# EAGLE design forcefoot (EAGLE 6.1)
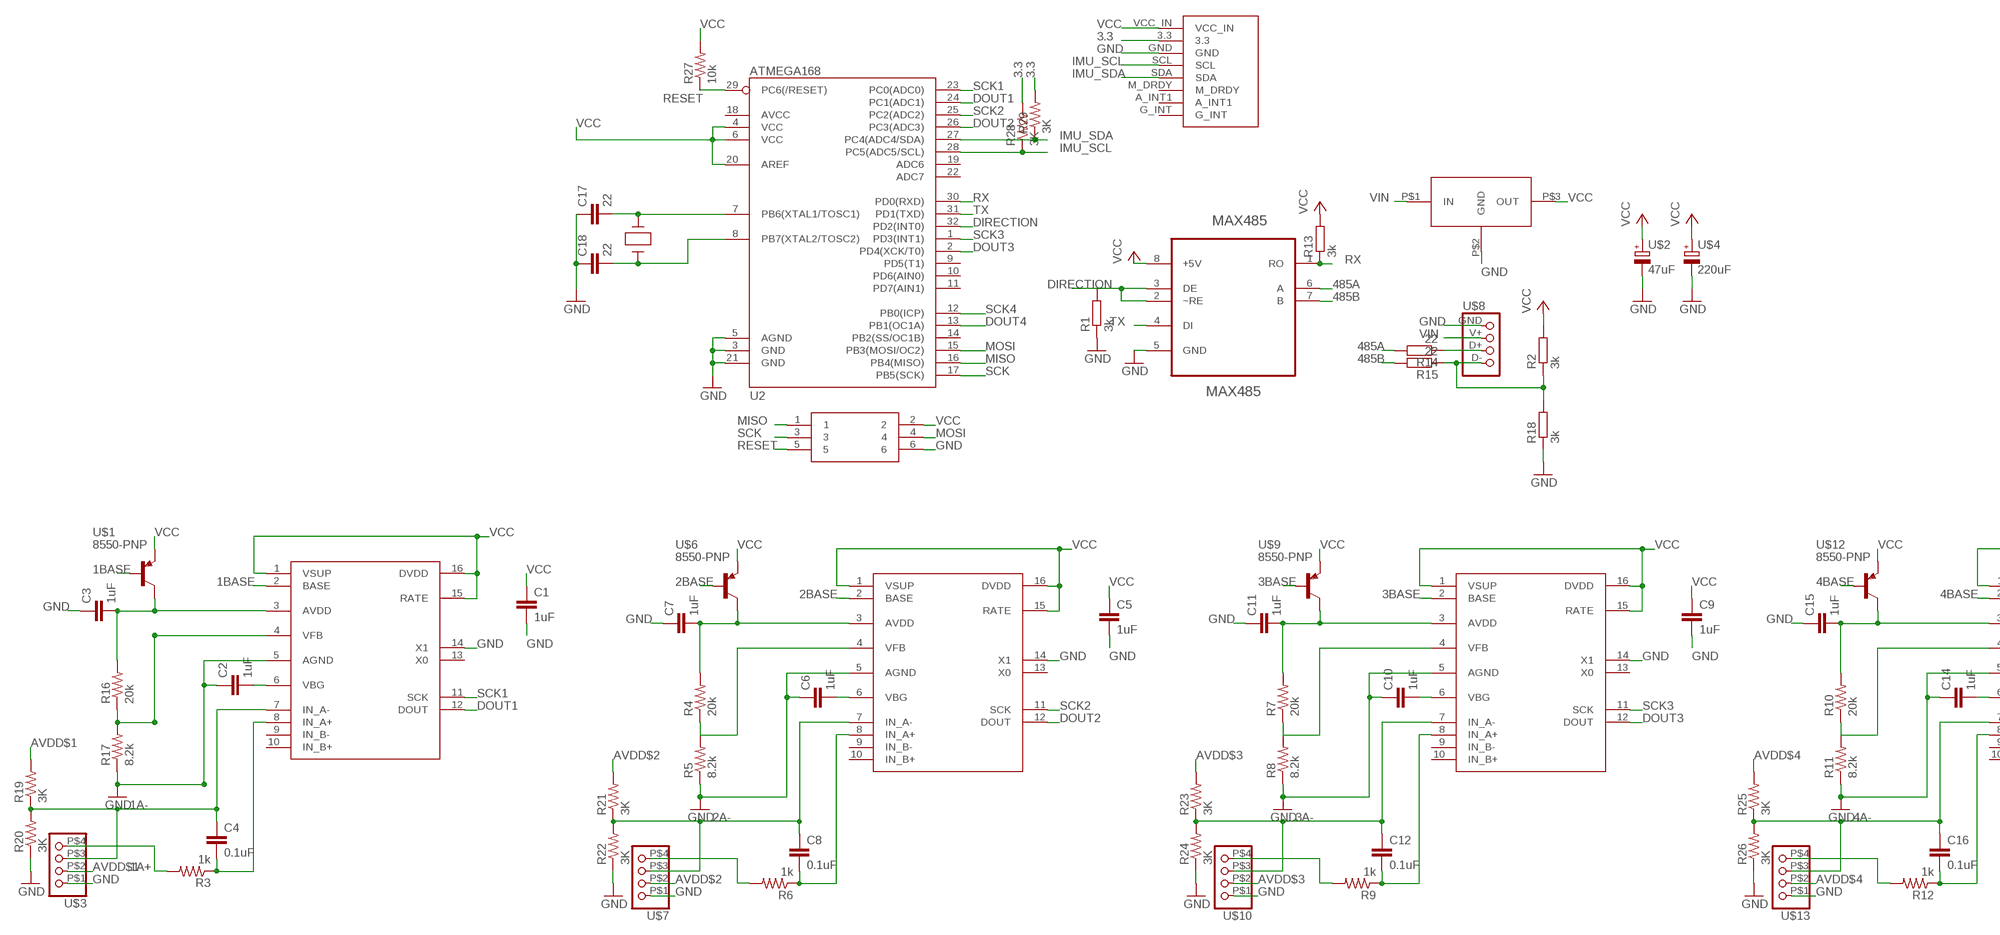
[diagram p0: schematic, sheet 1, part 1 of 2]
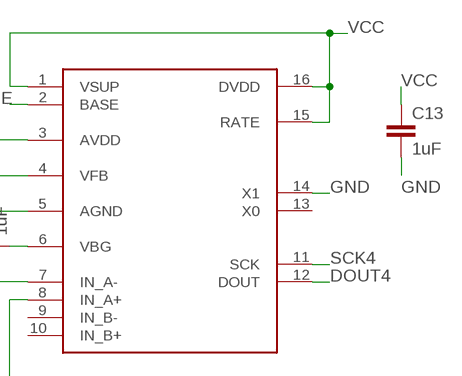
[diagram p1: schematic, sheet 1, part 2 of 2]

## Parts
C1  1uF  CAP0805  [0805]
C2  1uF  CAP0805  [0805]
C3  1uF  CAP0805  [0805]
C4  0.1uF  CAP0805  [0805]
C5  1uF  CAP0805  [0805]
C6  1uF  CAP0805  [0805]
C7  1uF  CAP0805  [0805]
C8  0.1uF  CAP0805  [0805]
C9  1uF  CAP0805  [0805]
C10  1uF  CAP0805  [0805]
C11  1uF  CAP0805  [0805]
C12  0.1uF  CAP0805  [0805]
C13  1uF  CAP0805  [0805]
C14  1uF  CAP0805  [0805]
C15  1uF  CAP0805  [0805]
C16  0.1uF  CAP0805  [0805]
C17  22  C_EU_22PF  [C0603]
C18  22  C_EU_22PF  [C0603]
HX1  HX711SO16  [SO16]
HX2  HX711SO16  [SO16]
HX3  HX711SO16  [SO16]
HX4  HX711SO16  [SO16]
MAX485  MAX485  [SO8]
R1  3k  RESISTANCE-R0805  [R0805]
R2  3k  RESISTANCE-R0805  [R0805]
R3  1k  RESISTOR0805-RES  [0805]
R4  20k  RESISTOR0805-RES  [0805]
R5  8.2k  RESISTOR0805-RES  [0805]
R6  1k  RESISTOR0805-RES  [0805]
R7  20k  RESISTOR0805-RES  [0805]
R8  8.2k  RESISTOR0805-RES  [0805]
R9  1k  RESISTOR0805-RES  [0805]
R10  20k  RESISTOR0805-RES  [0805]
R11  8.2k  RESISTOR0805-RES  [0805]
R12  1k  RESISTOR0805-RES  [0805]
R13  3k  RESISTANCE-R0805  [R0805]
R14  22  RESISTANCE-R0805  [R0805]
R15  22  RESISTANCE-R0805  [R0805]
R16  20k  RESISTOR0805-RES  [0805]
R17  8.2k  RESISTOR0805-RES  [0805]
R18  3k  RESISTANCE-R0805  [R0805]
R19  3K  RESISTOR0805-RES  [0805]
R20  3K  RESISTOR0805-RES  [0805]
R21  3K  RESISTOR0805-RES  [0805]
R22  3K  RESISTOR0805-RES  [0805]
R23  3K  RESISTOR0805-RES  [0805]
R24  3K  RESISTOR0805-RES  [0805]
R25  3K  RESISTOR0805-RES  [0805]
R26  3K  RESISTOR0805-RES  [0805]
R27  10k  RESISTOR0805-RES  [0805]
R28  3K  RESISTOR0805-RES  [0805]
R29  3K  RESISTOR0805-RES  [0805]
U2  ATMEGA168  [TQFP32-08]
U$1  8550-PNP  [SOT-23]
U$2  47uF  CPOL_EUPANASONIC_D  [PANASONIC_D]
U$3  CONNEC_1X041.5  [4P1.5]
U$4  220uF  CPOL_EUPANASONIC_D8  [PANASONIC_D8]
U$5  REG_5V  [TRACOPOWER]
U$6  8550-PNP  [SOT-23]
U$7  CONNEC_1X041.5  [4P1.5]
U$8  CONNEC_1X04_485  [CONNEC_485]
U$9  8550-PNP  [SOT-23]
U$10  CONNEC_1X041.5  [4P1.5]
U$12  8550-PNP  [SOT-23]
U$13  CONNEC_1X041.5  [4P1.5]
U$17  GY-85  [GY-85]
U$28  CONNEC_2X03  [CONNEC_2X03]
XTAL1  QUARTZ  [HC49US]

## Nets
1A+: R3.2 U$3.P$4
1A-: C4.1 HX1.7(IN_A-) R19.1 R20.2 U$3.P$3
1BASE: HX1.2(BASE) U$1.1(B)
2A-: C8.1 HX2.7(IN_A-) R21.1 R22.2 U$7.P$3
2BASE: HX2.2(BASE) U$6.1(B)
3.3: R28.2 R29.2 U$17.3.3
3A-: C12.1 HX3.7(IN_A-) R23.1 R24.2 U$10.P$3
3BASE: HX3.2(BASE) U$9.1(B)
4A-: C16.1 HX4.7(IN_A-) R25.1 R26.2 U$13.P$3
4BASE: HX4.2(BASE) U$12.1(B)
485A: MAX485.6(A) R14.2
485B: MAX485.7(B) R15.2
AVDD$1: C3.2 HX1.3(AVDD) R16.2 R19.2 U$1.3(C) U$3.P$2
AVDD$2: C7.2 HX2.3(AVDD) R4.2 R21.2 U$6.3(C) U$7.P$2
AVDD$3: C11.2 HX3.3(AVDD) R7.2 R23.2 U$9.3(C) U$10.P$2
AVDD$4: C15.2 HX4.3(AVDD) R10.2 R25.2 U$12.3(C) U$13.P$2
DIRECTION: MAX485.2(~RE) MAX485.3(DE) R1.2 U2.32(PD2(INT0))
DOUT1: HX1.12(DOUT) U2.24(PC1(ADC1))
DOUT2: HX2.12(DOUT) U2.26(PC3(ADC3))
DOUT3: HX3.12(DOUT) U2.2(PD4(XCK/T0))
DOUT4: HX4.12(DOUT) U2.13(PB1(OC1A))
GND: C1.2 C2.1 C3.1 C5.2 C6.1 C7.1 C9.2 C10.1 C11.1 C13.2 C14.1 C15.1 C17.1 C18.1 HX1.5(AGND) HX1.14(X1) HX2.5(AGND) HX2.14(X1) HX3.5(AGND) HX3.14(X1) HX4.5(AGND) HX4.14(X1) MAX485.5(GND) R1.1 R5.1 R8.1 R11.1 R17.1 R18.1 R20.1 R22.1 R24.1 R26.1 U2.3(GND) U2.5(AGND) U2.21(GND) U$2.- U$3.P$1 U$4.- U$5.P$2(GND) U$7.P$1 U$8.GND U$10.P$1 U$13.P$1 U$17.GND U$28.6
IMU_SCL: R28.1 U2.28(PC5(ADC5/SCL)) U$17.SCL
IMU_SDA: R29.1 U2.27(PC4(ADC4/SDA)) U$17.SDA
INAP$1: C4.2 HX1.8(IN_A+) R3.1
INAP$2: C8.2 HX2.8(IN_A+) R6.1
INAP$3: C12.2 HX3.8(IN_A+) R9.1
INAP$4: C16.2 HX4.8(IN_A+) R12.1
MISO: U2.16(PB4(MISO)) U$28.1
MOSI: U2.15(PB3(MOSI/OC2)) U$28.4
N$1: C2.2 HX1.6(VBG)
N$3: C6.2 HX2.6(VBG)
N$4: R6.2 U$7.P$4
N$5: C10.2 HX3.6(VBG)
N$6: R9.2 U$10.P$4
N$7: C14.2 HX4.6(VBG)
N$8: R12.2 U$13.P$4
N$19: C17.2 U2.7(PB6(XTAL1/TOSC1)) XTAL1.2
N$20: C18.2 U2.8(PB7(XTAL2/TOSC2)) XTAL1.1
RESET: R27.1 U2.29(PC6(/RESET)) U$28.5
RS+: R14.1 U$8.D+
RS-: R2.1 R15.1 R18.2 U$8.D-
RX: MAX485.1(RO) R13.1 U2.30(PD0(RXD))
SCK: U2.17(PB5(SCK)) U$28.3
SCK1: HX1.11(SCK) U2.23(PC0(ADC0))
SCK2: HX2.11(SCK) U2.25(PC2(ADC2))
SCK3: HX3.11(SCK) U2.1(PD3(INT1))
SCK4: HX4.11(SCK) U2.12(PB0(ICP))
TX: MAX485.4(DI) U2.31(PD1(TXD))
VCC: C1.1 C5.1 C9.1 C13.1 HX1.1(VSUP) HX1.15(RATE) HX1.16(DVDD) HX2.1(VSUP) HX2.15(RATE) HX2.16(DVDD) HX3.1(VSUP) HX3.15(RATE) HX3.16(DVDD) HX4.1(VSUP) HX4.15(RATE) HX4.16(DVDD) MAX485.8(+5V) R2.2 R13.2 R27.2 U2.4(VCC) U2.6(VCC) U2.20(AREF) U$1.2(E) U$2.+ U$4.+ U$5.P$3(OUT) U$6.2(E) U$9.2(E) U$12.2(E) U$17.VCC_IN U$28.2
VFB$1: HX1.4(VFB) R16.1 R17.2
VFB$2: HX2.4(VFB) R4.1 R5.2
VFB$3: HX3.4(VFB) R7.1 R8.2
VFB$4: HX4.4(VFB) R10.1 R11.2
VIN: U$5.P$1(IN) U$8.V+
Unconnected: HX1.9(IN_B-) HX1.10(IN_B+) HX1.13(X0) HX2.9(IN_B-) HX2.10(IN_B+) HX2.13(X0) HX3.9(IN_B-) HX3.10(IN_B+) HX3.13(X0) HX4.9(IN_B-) HX4.10(IN_B+) HX4.13(X0) U2.9(PD5(T1)) U2.10(PD6(AIN0)) U2.11(PD7(AIN1)) U2.14(PB2(SS/OC1B)) U2.18(AVCC) U2.19(ADC6) U2.22(ADC7) U$17.A_INT1 U$17.G_INT U$17.M_DRDY

## Library data of the parts
C1-C16 = SparkFun-Passives:CAP: Capacitor Standard 0603 ceramic capacitor, and 0.1" leaded capacitor.
C17 C18 = rhoban:C_EU: non polarised condo
HX1-HX4 = rhoban:HX711
MAX485 = rhoban:MAX485; DATASHEET: max485.pdf; DESCRIPTION: ±15kV ESD-Protected, Slew-Rate-Limited, Low-Power, RS-485/RS-422 Transceivers; FARNELL_LINK: http://fr.farnell.com/maxim-integrated-products/max485eesa/transceiver-rs-485-422-cms/dp/1379973?Ntt=1379973; MPN: MAX485EESA+; OC_FARNELL: 1379973; OC_NEWARK: 68K4798; PACKAGE: SOIC-8; SUPPLIER: Maxim
R1 R2 R13-R15 R18 = rhoban:RESISTANCE: RESISTOR, European symbol
R3-R12 R16 R17 R19-R29 = SparkFun-Passives:RESISTOR: Resistor Basic schematic elements and footprints for 0603, 1206, and PTH resistors.
U2 = SparkFun-DigitalIC:ATMEGA168: Atmel 32-pin 8-bit micro, 16k flash.
U$1 U$6 U$9 U$12 = rhoban:8550-PNP
U$2 U$4 = rhoban:CPOL_EU: 680 uF 16 V : http://fr.farnell.com/panasonic/eeufr1c681l/condensateur-radial-16v-680uf/dp/1800635 680 uF 25 V : http://fr.farnell.com/panasonic/eeufr1e681l/capacitor-radial-25v-680uf-20/dp/2063069 330 uF 25 V : http://fr.farnell.com/panasonic/eeufr1e331/condensateur-radial-25v-330uf/dp/1800648?Ntt=eeufr1e331
U$3 U$7 U$8 U$10 U$13 = rhoban:CONNEC_1X04
U$5 = rhoban:REG_5V
U$17 = rhoban:GY-85
U$28 = rhoban:CONNEC_2X03
XTAL1 = rhoban:QUARTZ

## Board
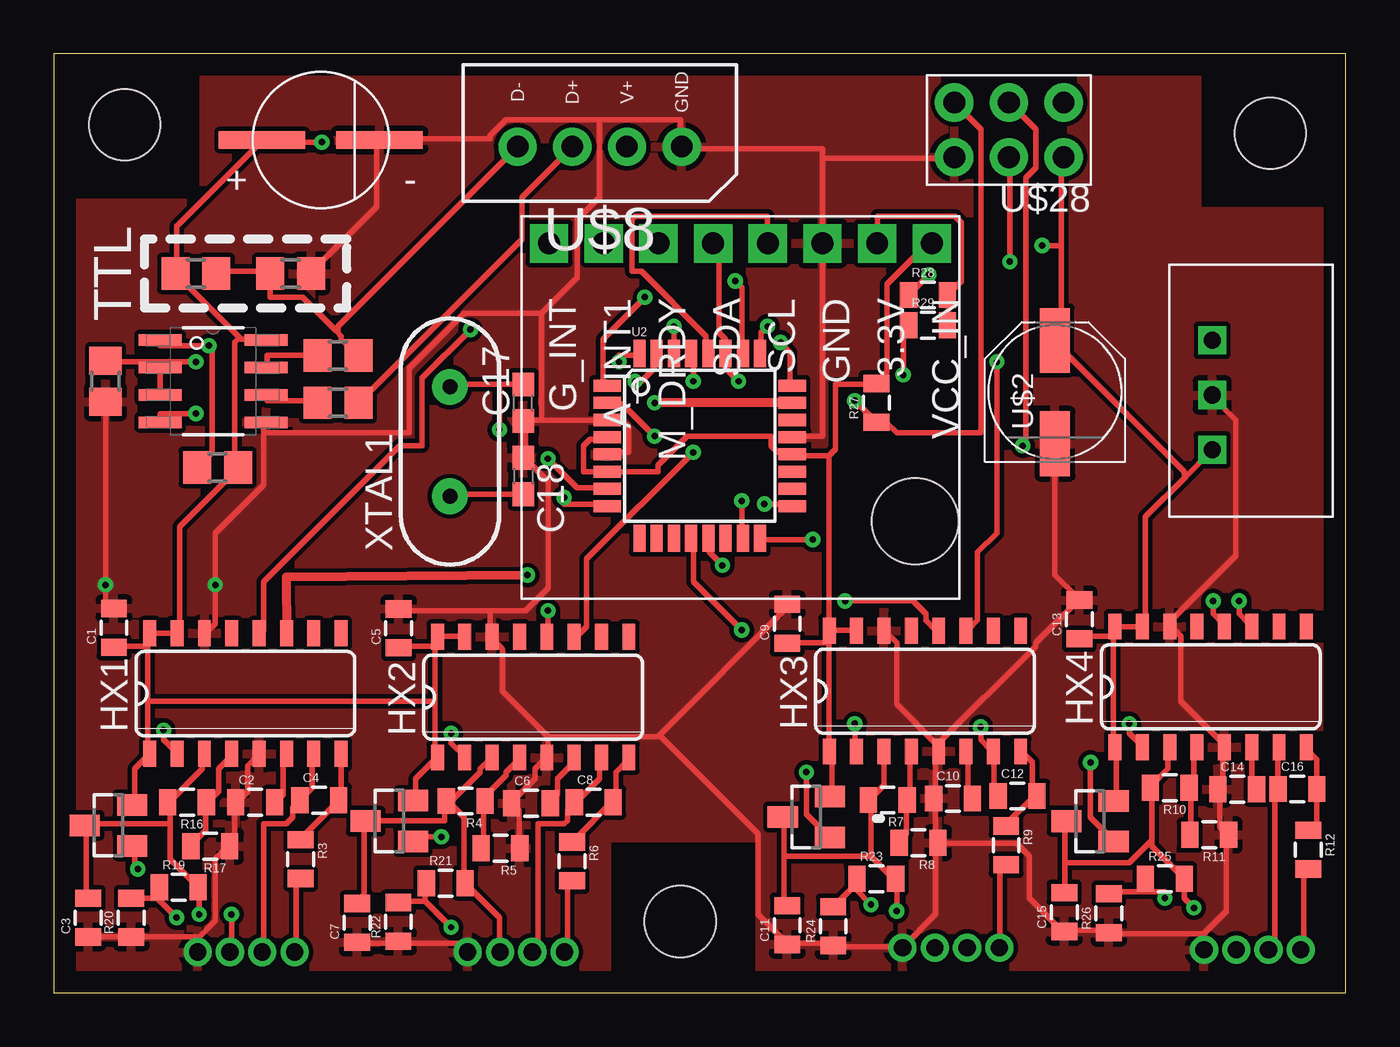
[diagram p2: board, top side]
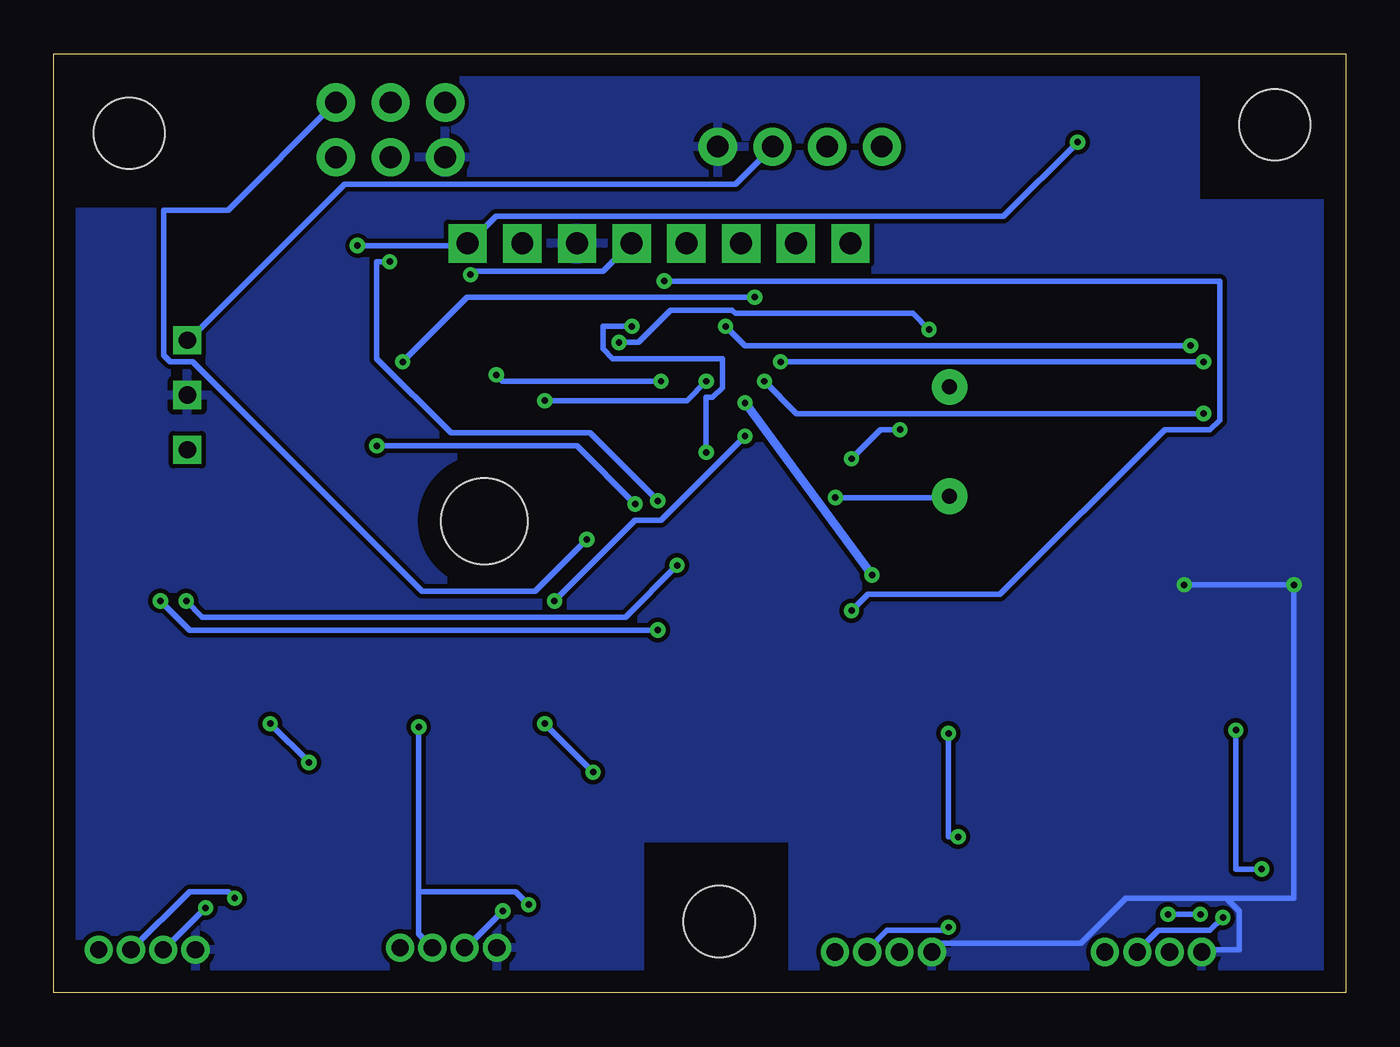
[diagram p3: board, bottom side, seen from below]

Size 60 x 43.6 mm. Coordinates in mm from the lower left corner, seen from the top.
Outline: 0,0 60,0 60,43.6 0,43.6 0,0
Copper layers (1*16): Top 0.035mm / dielectric 1.5mm / Bottom 0.035mm
Design rules: minimum track width 10mil, minimum drill 0.3mm, track to track 0.205mm, track to pad 0.205mm, pad to pad 0.205mm, via to via 0.205mm, smd to smd 8mil, copper to edge 40mil, drill to drill 8mil, minimum pad ring 10mil, minimum via ring 8mil, stop-mask expansion 4mil, vias tented up to drill 25mil, thermal gap 10mil
tRestrict: area 0.1,36.9 to 6.8,44; area 53.3,36.5 to 60,43.6; area 25.9,-0.1 to 32.6,7
bRestrict: area 0.1,36.9 to 6.8,44; area 53.3,36.5 to 60,43.6; area 25.9,-0.1 to 32.6,7

### Footprints (pad centres in the part's own frame; a part is rotated, then mirrored left to right if it is on the bottom)
0805 = smd 0.8 x 1.2: 1 -0.9,0; 2 0.9,0
C0603 = smd 1.1 x 1: 1 -0.85,0; 2 0.85,0
SO16 = smd 1.2 x 0.6: 1 -2.8,4.445; 2 -2.8,3.175; 3 -2.8,1.905; 4 -2.8,0.635; 5 -2.8,-0.635; 6 -2.8,-1.905; 7 -2.8,-3.175; 8 -2.8,-4.445; 9 2.8,-4.445; 10 2.8,-3.175; 11 2.8,-1.905; 12 2.8,-0.635; 13 2.8,0.635; 14 2.8,1.905; 15 2.8,3.175; 16 2.8,4.445
SO8 = smd 1.981 x 0.533: 1 -2.464,1.905; 2 -2.464,0.635; 3 -2.464,-0.635; 4 -2.464,-1.905; 5 2.464,-1.905; 6 2.464,-0.635; 7 2.464,0.635; 8 2.464,1.905
R0805 = smd 1.3 x 1.5: 1 -0.95,0; 2 0.95,0
TQFP32-08 = smd 1.27 x 0.559: 1 -4.293,2.8; 2 -4.293,2; 3 -4.293,1.2; 4 -4.293,0.4; 5 -4.293,-0.4; 6 -4.293,-1.2; 7 -4.293,-2; 8 -4.293,-2.8; 17 4.293,-2.8; 18 4.293,-2; 19 4.293,-1.2; 20 4.293,-0.4; 21 4.293,0.4; 22 4.293,1.2; 23 4.293,2; 24 4.293,2.8 | smd 0.559 x 1.27: 9 -2.8,-4.293; 10 -2,-4.293; 11 -1.2,-4.293; 12 -0.4,-4.293; 13 0.4,-4.293; 14 1.2,-4.293; 15 2,-4.293; 16 2.8,-4.293; 25 2.8,4.293; 26 2,4.293; 27 1.2,4.293; 28 0.4,4.293; 29 -0.4,4.293; 30 -1.2,4.293; 31 -2,4.293; 32 -2.8,4.293
SOT-23 = smd 1 x 1.4: 1 -0.95,-1.1; 2 0.95,-1.1; 3 0,1.1
PANASONIC_D = smd 3 x 1.4: + 2.4,0; - -2.4,0
4P1.5 = drill 0.8: P$1 0,0; P$2 1.5,0; P$3 3,0; P$4 4.5,0
PANASONIC_D8 = smd 4.016 x 0.8: + 2.73,0; - -2.73,0
TRACOPOWER = drill 0.8 square: P$1 3.5,2; P$2 6.04,2; P$3 8.58,2
CONNEC_485 = drill 1 pad 1.778: D+ 7.62,3.81; D- 10.16,3.81; GND 2.54,3.81; V+ 5.08,3.81
STAND-OFF = hole 3.302: 0,0
GY-85 = drill 1.016 pad 1.778 square: 3.3 0,15.24; A_INT1 0,2.54; G_INT 0,0; GND 0,12.7; M_DRDY 0,5.08; SCL 0,10.16; SDA 0,7.62; VCC_IN 0,17.78 | hole 4: 12.9,17
CONNEC_2X03 = drill 1.016 pad 1.778: 1 0,-2.54; 2 0,0; 3 2.54,-2.54; 4 2.54,0; 5 5.08,-2.54; 6 5.08,0
HC49US = drill 0.7 pad 1.651: 1 -2.54,0; 2 2.54,0

### Placement (x,y rotation side)
C1  2.79,16.95 90 top
C2  9.35,8.85 0 top
C3  1.6,3.5 90 top
C4  12.33,8.95 0 top
C5  16.01,16.93 90 top
C6  22.16,8.8 0 top
C7  14.09,3.25 90 top
C8  25.07,8.85 0 top
C9  34.06,17.14 90 top
C10  41.76,9.03 0 top
C11  34.06,3.15 90 top
C12  44.76,9.14 0 top
C13  47.63,17.34 90 top
C14  54.96,9.46 0 top
C15  46.93,3.75 90 top
C16  57.76,9.47 0 top
C17  21.8,27.4 90 top
C18  21.8,24 270 top
HX1  8.9,13.9 90 top
HX2  22.26,13.73 90 top
HX3  40.46,14.01 90 top
HX4  53.73,14.21 90 top
MAX485  7.4,28.4 0 top
R1  2.4,28.4 90 top
R2  6.6,33.4 180 top
R3  11.46,6.21 270 top
R4  19.13,8.91 180 top
R5  20.74,6.71 180 top
R6  24.07,6.11 270 top
R7  38.73,8.96 180 top
R8  40.16,6.97 180 top
R9  44.23,6.85 270 top
R10  51.83,9.53 180 top
R11  53.66,7.34 180 top
R12  58.26,6.65 270 top
R13  7.6,24.4 0 top
R14  13.2,27.4 180 top
R15  13.2,29.6 180 top
R16  6.19,8.86 180 top
R17  7.26,6.82 180 top
R18  11,33.4 180 top
R19  5.8,4.9 0 top
R20  3.6,3.5 90 top
R21  18.2,5.1 0 top
R22  16,3.3 90 top
R23  38.2,5.3 0 top
R24  36.2,3.1 90 top
R25  51.6,5.3 0 top
R26  49,3.7 90 top
R27  38.2,27.4 90 top
R28  40.6,32.4 0 top
R29  40.6,31 0 top
U2  30,25.4 0 top
U$1  2.54,7.78 90 top
U$2  46.5,27.9 90 top
U$3  6.68,1.9 0 top
U$4  12.4,39.6 180 top
U$5  51.8,33.8 270 top
U$6  15.58,7.98 90 top
U$7  19.22,1.9 0 top
U$8  31.7,43.1 180 top
U$9  34.95,8.17 90 top
U$10  39.42,2.1 0 top
U$11  [STAND-OFF]  3.3,40.31 0 top
U$12  48.12,7.97 90 top
U$13  53.42,2 0 top
U$14  [STAND-OFF]  56.5,39.91 0 top
U$16  [STAND-OFF]  29.1,3.31 0 top
U$17  23,34.8 270 top
U$28  46.9,38.8 180 top
XTAL1  18.4,25.6 90 top

### Tracks (layer width: path | path; a pad name or v marks a point on that pad's centre or on a via)
1A+
  Top 0.254: R3.2 11.4,5.3 11.25,5.15 11.25,2 U$3.P$4
1A-  (via drill 0.3)
  Top 0.254: HX1.7 12,11 12,9.5 11.55,9.05 C4.1 11.4,8.9 11.1,8.6 11.1,8.15 10.8,7.85 9.75,7.85 9.75,2 U$3.P$3 | 4.8,4.4 R20.2 | 4.8,4.4 4.8,4.85 R19.1 4.8,4.4 | v5.7,3.5 4.8,4.4
  Bottom 0.254: v5.7,3.5 6.3,2.9 8.7,2.9 9.6,2 U$3.P$3
1BASE  (via drill 0.3)
  Top 0.254: v5.1,12.2 5.1,11.75 5.7,11.15 HX1.2 | v3.9,5.75 3.75,5.9 3.75,6.8 U$1.1
  Bottom 0.254: v5.1,12.2 5.1,5.75 v3.9,5.75
2A-  (via drill 0.3)
  Top 0.254: HX2.7 25.35,10.85 25.35,9.95 24.3,8.9 C8.1 24.15,8.75 23.85,8.45 23.85,8 23.7,7.85 22.5,7.85 22.5,2.15 22.35,2 U$7.P$3 | 17.25,4.25 16.05,4.25 R22.2 | 17.25,4.25 17.25,5 R21.1 | v18.45,3.05 17.25,4.25
  Bottom 0.254: v18.45,3.05 18.6,2.9 21.3,2.9 22.2,2 U$7.P$3
2BASE  (via drill 0.3)
  Top 0.254: v18.45,12.05 18.45,11.6 19.05,11 HX2.2 | v18,7.25 16.8,7.25 16.8,7.1 U$6.1
  Bottom 0.254: v18.45,12.05 18.45,7.25 v18,7.25
3.3
  Top 0.254: R29.2 41.55,31.1 41.55,32.3 R28.2 42.15,33.05 42.15,35.75 41.85,36.05 38.25,36.05 38.25,34.85 U$17.3.3
3A-  (via drill 0.3)
  Top 0.254: R24.2 37.2,5 37.2,5.3 R23.1 37.2,4.85 v37.95,4.1 | C12.1 43.65,9.35 43.65,11.15 HX3.7 43.5,11.3 43.05,11.75 v43.05,12.35
  Bottom 0.254: 43.05,4.7 43.05,2.75 42.45,2.15 U$10.P$3 | 43.05,4.7 v43.05,12.35 | v37.95,4.1 38.55,4.7 43.05,4.7
3BASE  (via drill 0.3)
  Top 0.254: v37.2,12.5 37.2,11.3 HX3.2 | v34.95,10.25 34.95,8.3 36,7.25 U$9.1
  Bottom 0.254: v34.95,10.25 v37.2,12.5
4A-  (via drill 0.3)
  Top 0.254: 50.7,4.7 49.05,4.7 R26.2 | R25.1 50.7,4.7 | HX4.7 56.85,11.3 56.85,9.5 C16.1 56.85,9.35 56.7,9.2 56.7,2.15 56.55,2 U$13.P$3 | 50.7,4.7 51.6,4.7 v51.6,4.4
  Bottom 0.254: v51.6,4.4 51.9,4.7 53.7,4.7 56.4,2 U$13.P$3
4BASE  (via drill 0.3)
  Top 0.254: v49.95,12.5 49.95,12.05 50.55,11.45 HX4.2 | v48.15,10.7 48.15,8.15 49.2,7.1 U$12.1
  Bottom 0.254: v48.15,10.7 v49.95,12.5
485A
  Top 0.254: R14.2 12.15,27.5 9.9,27.5 9.9,27.65 MAX485.6
485B
  Top 0.254: R15.2 9.9,29.6 9.9,29.15 MAX485.7
AVDD$1  (via drill 0.3)
  Top 0.254: C3.2 1.5,4.4 1.5,7.7 U$1.3 1.5,7.85 5.4,7.85 | HX1.3 6.9,11 6.9,10.4 5.4,8.9 R16.2 5.4,8.75 5.4,7.85 | 5.4,7.85 5.4,6.2 R19.2 6.75,4.85 v6.75,3.65 | v8.25,3.65 8.25,2 U$3.P$2
  Bottom 0.254: v6.75,3.65 v8.25,3.65
AVDD$2
  Top 0.254: C7.2 14.1,4.25 14.4,4.55 14.4,7.85 U$6.3 14.55,8 18.15,8 18.15,8.9 R4.2 | U$7.P$2 20.7,2 20.7,3.5 R21.2 19.05,5.15 19.05,8.15 18.3,8.9 R4.2 | HX2.3 20.25,10.85 19.8,10.4 19.8,10.25 18.45,8.9 R4.2
AVDD$3  (via drill 0.3)
  Top 0.254: 33.9,6.35 33.9,8.15 U$9.3 | 33.9,6.35 33.9,4.25 34.05,4.1 C11.2 | HX3.3 38.55,11.15 38.55,9.65 37.95,9.05 R7.2 37.95,8.9 37.95,6.35 | 37.95,6.35 39,5.3 R23.2 39.15,5.3 v39.15,3.8 | 37.95,6.35 33.9,6.35
  Bottom 0.254: v39.15,3.8 40.8,2.15 U$10.P$2
AVDD$4  (via drill 0.3)
  Top 0.254: 46.95,6.05 46.95,7.85 U$12.3 | 46.95,6.05 46.95,4.7 C15.2 | HX4.3 51.75,11.3 51.75,10.4 51,9.65 R10.2 51,9.5 51,7.1 | 51,7.1 51,6.8 R25.2 52.5,4.4 v52.95,3.95 | 46.95,6.05 49.95,6.05 51,7.1
  Bottom 0.254: v52.95,3.95 54.9,2 U$13.P$2
DIRECTION  (via drill 0.3)
  Top 0.254: v26.25,29.3 26.25,29.6 27.15,29.6 U2.32 | 4.95,29.3 v6.6,29.3 | 4.95,29.3 4.95,29.15 MAX485.2 | 4.95,29.3 2.4,29.3 R1.2 | 4.95,29.3 MAX485.2 | MAX485.3 4.95,27.8 4.95,29 MAX485.2
  Bottom 0.254: v6.6,29.3 v26.25,29.3
DOUT1  (via drill 0.3)
  Top 0.254: v19.35,30.8 17.1,28.55 17.1,25.4 16.05,25.4 9.75,19.1 9.75,16.85 9.6,16.7 HX1.12 | v33.75,30.2 34.2,29.75 34.2,28.25 U2.24
  Bottom 0.254: v19.35,30.8 20.1,31.55 28.35,31.55 28.5,31.7 31.35,31.7 32.85,30.2 v33.75,30.2
DOUT2  (via drill 0.3)
  Top 0.254: v22.95,17.75 22.95,16.55 HX2.12 | v31.65,33.05 31.95,32.75 31.95,29.75 U2.26
  Bottom 0.254: v22.95,17.75 22.2,18.5 16.05,18.5 8.4,26.15 6.3,26.15 5.85,26.6 5.85,33.05 v31.65,33.05
DOUT3  (via drill 0.3)
  Top 0.254: v36.75,18.2 39.9,18.2 40.5,17.6 40.5,17.3 40.95,16.85 HX3.12 | v27.9,25.85 26.4,27.35 25.8,27.35 U2.2
  Bottom 0.254: v36.75,18.2 33,21.95 31.8,21.95 v27.9,25.85
DOUT4  (via drill 0.3)
  Top 0.254: v53.85,18.2 53.85,17.6 54.3,17.15 HX4.12 | v31.05,19.85 30.45,20.45 30.45,21.05 U2.13
  Bottom 0.254: v53.85,18.2 53.1,17.45 33.45,17.45 v31.05,19.85
GND  (via drill 0.3)
  Top 0.254: 53.4,2.75 49.05,2.75 R26.1 48.9,2.9 46.95,2.9 C15.1 46.8,2.9 45.3,4.4 45.3,6.35 44.7,6.95 41.1,6.95 R8.1 | 53.4,2.75 53.4,2 U$13.P$1 | U$5.P$2 53.85,27.65 54.9,26.6 54.9,20.3 51.9,17.3 51.9,17.15 HX4.14 51.9,17 52.35,16.55 52.35,13.55 54.3,11.6 54.3,11.45 HX4.5 54.3,11.3 54.3,9.65 54.15,9.5 C14.1 54.15,9.35 54.15,7.7 54.45,7.4 R11.1 54.45,7.25 54.45,3.8 53.4,2.75 | U$2.- 46.5,19.4 47.55,18.35 C13.2 47.55,18.2 45.6,16.25 45.6,16.1 40.95,11.45 | R8.1 40.95,7.1 40.95,8.9 C10.1 40.95,9.05 40.95,11.15 HX3.5 | 40.95,11.45 40.95,11.3 HX3.5 | 40.95,11.45 40.95,11.6 39.15,13.4 39.15,16.25 38.7,16.7 HX3.14 | R8.1 40.95,6.95 40.95,3.65 39.45,2.15 U$10.P$1 39.3,2.15 36.3,2.15 R24.1 36.15,2.3 34.2,2.3 C11.1 34.05,2.3 32.7,3.65 32.7,7.4 28.12,11.97 | 40.95,11.45 HX3.5 | R18.1 12,33.5 15,36.5 15,39.5 U$4.- 15.15,39.65 20.25,39.65 20.25,39.8 21,40.55 25.35,40.55 | U2.21 34.35,25.85 35.7,25.85 U$17.GND 35.7,38.75 | 35.7,38.75 41.7,38.75 U$28.6 | 35.7,38.75 35.7,39.2 29.25,39.2 U$8.GND 29.1,39.35 29.1,40.55 25.35,40.55 | R1.1 v2.4,18.95 2.4,18.2 2.7,17.9 C1.2 | C7.1 14.1,2.3 15.9,2.3 R22.1 16.05,2.3 19.2,2.3 19.2,2 U$7.P$1 | HX1.5 9.45,11 9,10.55 9,9.35 8.55,8.9 C2.1 8.4,8.75 8.4,7.1 8.25,6.95 R17.1 8.1,6.8 7.5,6.2 7.5,3.35 6.6,2.45 | C3.1 R20.1 6.6,2.6 6.6,2.45 | 6.6,2.45 6.6,2 U$3.P$1 6.6,2.45 | 9.75,26 9.75,26.45 MAX485.5 | 9.75,26 9.75,23.6 7.5,21.35 v7.5,18.95 7.5,17.15 7.05,16.7 HX1.14 | U2.5 25.8,25.1 26.7,25.1 26.7,26.3 26.4,26.6 U2.3 22.65,26.6 | 22.65,26.6 21.9,26.6 C17.1 21.9,26.45 21.9,24.95 C18.1 21.9,24.8 22.95,23.75 22.95,18.8 21.9,17.75 20.25,17.75
  Top 0.254: 20.25,17.75 16.05,17.75 C5.2 | 20.25,17.75 20.25,16.55 HX2.14 20.4,16.4 20.85,15.95 20.85,14 22.95,11.9 | R5.1 21.6,6.8 21.6,8.45 21.3,8.75 C6.1 21.3,8.9 22.35,9.95 22.35,10.4 22.8,10.85 HX2.5 22.95,11 22.95,11.9 | 28.12,11.97 28.05,11.9 22.95,11.9 | 28.12,11.97 34.05,17.9 C9.2 | 9.75,26 16.5,26 16.5,29 19.05,31.55 22.65,31.55 | 22.65,26.6 22.65,31.55 | 25.35,40.55 25.35,36.95 24.3,35.9 24.3,33.2 22.65,31.55
  Bottom 0.254: 5.47,4.33 4.95,3.8 4.95,2 6.6,2 U$3.P$1 | 5.47,4.33 5.55,4.4 10.2,4.4 12.3,2.3 18.9,2.3 19.2,2 U$7.P$1 | 5.47,4.33 5.4,4.4 2.4,4.4 v2.4,18.95 v7.5,18.95
  pour Bottom: -9.2,53.4 77,53.4 77,-19.4 -23.7,-19.4 -23.7,27.4
  pour Top: -2.1,45.7 66.6,45.7 66.6,-9 -14.5,-9 -14.5,19.1
IMU_SCL  (via drill 0.3)
  Top 0.254: v40.65,33.35 R28.1 | U2.28 30.3,29.75 30.3,30.5 27.3,33.5 26.85,33.5 26.85,35.9 27,36.05 33.15,36.05 33.15,34.85 U$17.SCL
  Bottom 0.254: v40.65,33.35 40.5,33.5 34.5,33.5 33.3,34.7 U$17.SCL
IMU_SDA  (via drill 0.3)
  Top 0.254: v39.45,28.7 39.45,30.8 39.6,30.95 R29.1 | v31.8,28.4 31.2,29 U2.27 31.2,30.35 30.9,30.65 30.9,34.55 30.75,34.7 U$17.SDA
  Bottom 0.254: v39.45,28.7 39.15,28.4 v31.8,28.4
INAP$1
  Top 0.254: R3.1 11.55,7.25 13.2,8.9 C4.2 13.35,9.05 13.35,11 HX1.8
INAP$2
  Top 0.254: R6.1 24.15,7.1 25.95,8.9 C8.2 26.1,8.9 26.1,10.25 26.7,10.85 HX2.8
INAP$3
  Top 0.254: R9.1 44.25,7.85 45.6,9.2 C12.2 45.45,9.2 45.45,10.7 45,11.15 HX3.8
INAP$4
  Top 0.254: HX4.8 58.2,11.3 58.65,10.85 58.65,9.5 C16.2 58.65,9.35 58.65,7.85 58.35,7.55 R12.1
MISO  (via drill 0.3)
  Top 0.254: v35.25,21.05 32.85,21.05 U2.16
  Bottom 0.254: v35.25,21.05 37.65,18.65 42.9,18.65 53.55,29.3 54.6,29.3 54.9,29.6 54.9,36.35 51.9,36.35 46.95,41.3 U$28.1
MOSI  (via drill 0.3)
  Top 0.254: v31.95,22.85 31.95,21.2 U2.15 | v44.4,33.95 44.4,38.75 U$28.4
  Bottom 0.254: v31.95,22.85 35.1,26 41.55,26 45,29.45 45,33.95 v44.4,33.95
N$1
  Top 0.254: C2.2 10.35,8.9 10.65,9.2 10.65,10.85 10.8,11 HX1.6
N$3
  Top 0.254: C6.2 23.1,8.9 23.4,9.2 23.4,9.95 24.15,10.7 24.15,10.85 HX2.6
N$4
  Top 0.254: R6.2 24,5.15 23.85,5 23.85,2 U$7.P$4
N$5
  Top 0.254: C10.2 42.6,9.05 42.45,9.2 42.45,11.15 HX3.6
N$6
  Top 0.254: R9.2 44.1,5.9 43.95,5.75 43.95,2.15 U$10.P$4
N$7
  Top 0.254: C14.2 55.8,9.5 55.65,9.65 55.65,11.3 HX4.6
N$8
  Top 0.254: R12.2 58.2,5.75 58.05,5.6 58.05,2 U$13.P$4
N$19  (via drill 0.3)
  Top 0.254: 20.7,28.25 18.45,28.25 XTAL1.2 | 20.7,28.25 C17.2 | v22.95,24.8 24.3,23.45 25.65,23.45 U2.7 | 20.7,28.25 v20.7,26.15
  Bottom 0.254: v22.95,24.8 21.6,26.15 v20.7,26.15
N$20  (via drill 0.3)
  Top 0.254: C18.2 18.45,23.15 XTAL1.1 | v23.7,23 23.7,22.7 25.65,22.7 U2.8
  Bottom 0.254: v23.7,23 18.45,23 XTAL1.1
RESET  (via drill 0.3)
  Top 0.254: U$28.5 41.85,41.3 43.05,40.1 43.05,26 39.15,26 38.7,26.45 38.25,26.45 R27.1 v37.2,27.5 | v29.7,28.4 29.7,29.6 U2.29
  Bottom 0.254: v29.7,28.4 30.6,27.5 v37.2,27.5
RS+
  Top 0.254: R14.1 21.75,35 21.75,36.95 24,39.2 U$8.D+
RS-
  Top 0.254: R2.1 7.65,33.5 10.05,33.5 R18.2 10.05,32.3 11.55,32.3 13.12,30.72 | 13.12,30.72 13.35,30.5 13.35,30.35 14.1,29.6 R15.1 | U$8.D- 13.2,30.95 13.2,30.8 13.12,30.72
RX  (via drill 0.3)
  Top 0.254: v28.8,30.95 U2.30 | MAX485.1 4.95,30.2 4.95,30.05 v7.2,30.05 7.35,29.9 7.35,25.1 R13.1
  Bottom 0.254: v28.8,30.95 27.9,30.05 v7.2,30.05
SCK  (via drill 0.3)
  Top 0.254: v33,22.7 34.2,22.7 U2.17 | v45,25.4 45.15,25.55 45.15,37.85 45.6,38.3 45.6,40.1 U$28.3
  Bottom 0.254: v33,22.7 35.7,25.4 v45,25.4
SCK1  (via drill 0.3)
  Top 0.406: U2.23 v27.9,27.4 | v22,19.4 10.8,19.3 HX1.11
  Bottom 0.406: v27.9,27.4 v22,19.4
SCK2  (via drill 0.3)
  Top 0.254: v29.7,25.1 24.75,20.15 24.75,17 24.3,16.55 HX2.11 | v33.15,30.95 32.85,30.65 32.85,29.75 U2.25
  Bottom 0.254: v29.7,25.1 29.7,27.65 29.4,27.65 28.95,28.1 28.95,29.45 34.05,29.45 34.5,29.9 34.5,30.95 v33.15,30.95
SCK3  (via drill 0.3)
  Top 0.254: v43.8,29.3 43.8,21.35 42.9,20.45 42.9,17.3 42.45,16.85 HX3.11 | v27.45,32.3 25.5,30.35 25.5,28.4 25.65,28.25 U2.1
  Bottom 0.254: v43.8,29.3 40.8,32.3 v27.45,32.3
SCK4  (via drill 0.3)
  Top 0.254: v55.05,18.2 55.05,17.6 55.5,17.15 HX4.11 | v31.95,16.85 29.7,19.1 29.7,21.05 U2.12
  Bottom 0.254: v55.05,18.2 53.7,16.85 v31.95,16.85
TX  (via drill 0.3)
  Top 0.254: v27,28.4 27.3,28.4 27.9,29 27.9,29.6 U2.31 | v6.6,26.9 4.95,26.9 4.95,26.6 MAX485.4
  Bottom 0.254: v27,28.4 25.5,26.9 v6.6,26.9
VCC  (via drill 0.3)
  Top 0.254: 8.62,30.43 8.7,30.35 9.75,30.35 MAX485.8 | 8.62,30.43 R2.2 5.7,33.5 5.7,35.6 9.6,39.5 U$4.+ 9.75,39.5 v12.45,39.5 | U$6.2 16.8,9.05 16.8,9.95 17.7,10.85 HX2.1 17.7,11 17.7,13.55 | 17.7,16.1 16.05,16.1 C5.1 | 17.7,16.1 17.7,16.4 HX2.16 | HX2.15 19.05,16.55 17.85,16.55 HX2.16 | 17.7,16.1 17.7,13.55 | 17.7,16.1 HX2.16 | U$1.2 3.75,8.75 3.75,10.4 4.35,11 HX1.1 4.35,11.15 4.35,13.55 | 4.35,16.1 2.85,16.1 C1.1 | 4.35,16.1 4.35,16.7 HX1.16 HX1.15 5.85,16.7 5.85,21.65 8.55,24.35 R13.2 8.4,24.35 8.4,30.2 8.62,30.43 | 4.35,16.1 4.35,13.55 | 4.35,13.55 17.7,13.55 | 46.8,34.7 46.8,38.75 U$28.2 | 46.8,34.7 46.8,30.65 46.5,30.35 U$2.+ 46.5,30.2 52.5,24.2 52.5,24.05 52.58,23.97 | U$12.2 49.35,9.05 49.35,11.3 HX4.1 49.2,11.45 49.2,16.55 | 49.2,16.55 47.7,16.55 C13.1 | 49.2,16.55 49.2,17 HX4.16 | HX4.16 49.35,17 HX4.15 50.7,17.15 50.7,22.1 52.58,23.97 | 49.2,16.55 HX4.16 | 52.58,23.97 53.7,25.1 U$5.P$3 | U$17.VCC_IN 40.65,34.85 38.7,32.9 38.7,28.85 38.25,28.4 R27.2 38.1,28.25 36.3,28.25 36.3,25.25 36,24.95 | U$9.2 36.15,9.2 36.15,11.15 HX3.1 36,11.3 36,16.25 | U2.4 25.65,25.7 24.9,25.7 24.6,25.4 24.6,24.2 U2.6 28.05,24.2 28.05,24.5 29.4,25.85 33.3,25.85 33.3,25.4 33.6,25.1 34.2,25.1 U2.20 34.35,24.95 36,24.95 | 36,16.25 34.2,16.25 C9.1 | 36,16.25 36,16.7 HX3.16 | HX3.15 37.2,16.85 36.15,16.85 HX3.16 | 36,24.95 36,16.85 HX3.16 | 36,16.25 HX3.16 | v45.9,34.7 46.8,34.7
  Bottom 0.254: v45.9,34.7 40.8,34.7 U$17.VCC_IN 40.65,34.85 39.45,36.05 15.9,36.05 v12.45,39.5
VFB$1
  Top 0.254: R17.2 6.45,6.95 7.05,7.55 7.05,8.75 R16.1 7.2,8.9 7.65,9.35 7.65,10.4 8.25,11 HX1.4
VFB$2
  Top 0.254: R5.2 19.95,6.8 19.95,8.9 R4.1 20.1,9.05 20.1,9.2 21,10.1 21,10.25 21.6,10.85 HX2.4
VFB$3
  Top 0.254: R8.2 39.3,7.1 39.6,7.4 39.6,8.9 R7.1 39.75,9.05 39.75,11.15 HX3.4
VFB$4
  Top 0.254: HX4.4 52.95,11.3 52.95,9.8 52.8,9.65 R10.1 52.8,9.5 52.8,7.4 R11.2
VIN
  Bottom 0.254: U$5.P$1 53.7,30.35 46.5,37.55 28.35,37.55 26.7,39.2 U$8.V+

### Text on the board
_tsilk: TTL